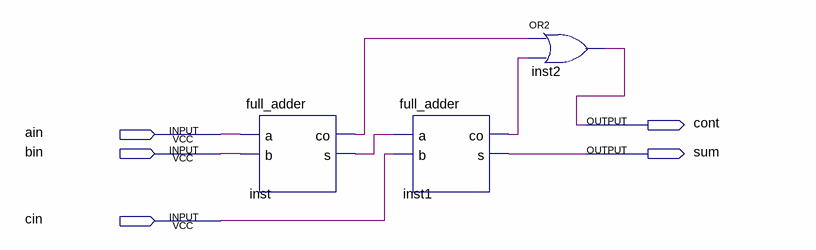
[diagram p0: schematic sheet]
// Quartus schematic adder.bdf as structural Verilog: 3 symbols, 5 pins
module adder (
  input  ain,
  input  bin,
  input  cin,
  output cont,
  output sum
);

  wire inst1_co, inst_co, inst_s;

  full_adder inst (.a(ain), .b(bin), .co(inst_co), .s(inst_s));
  full_adder inst1 (.a(inst_s), .b(cin), .co(inst1_co), .s(sum));
  or inst2 (cont, inst_co, inst1_co);
endmodule
